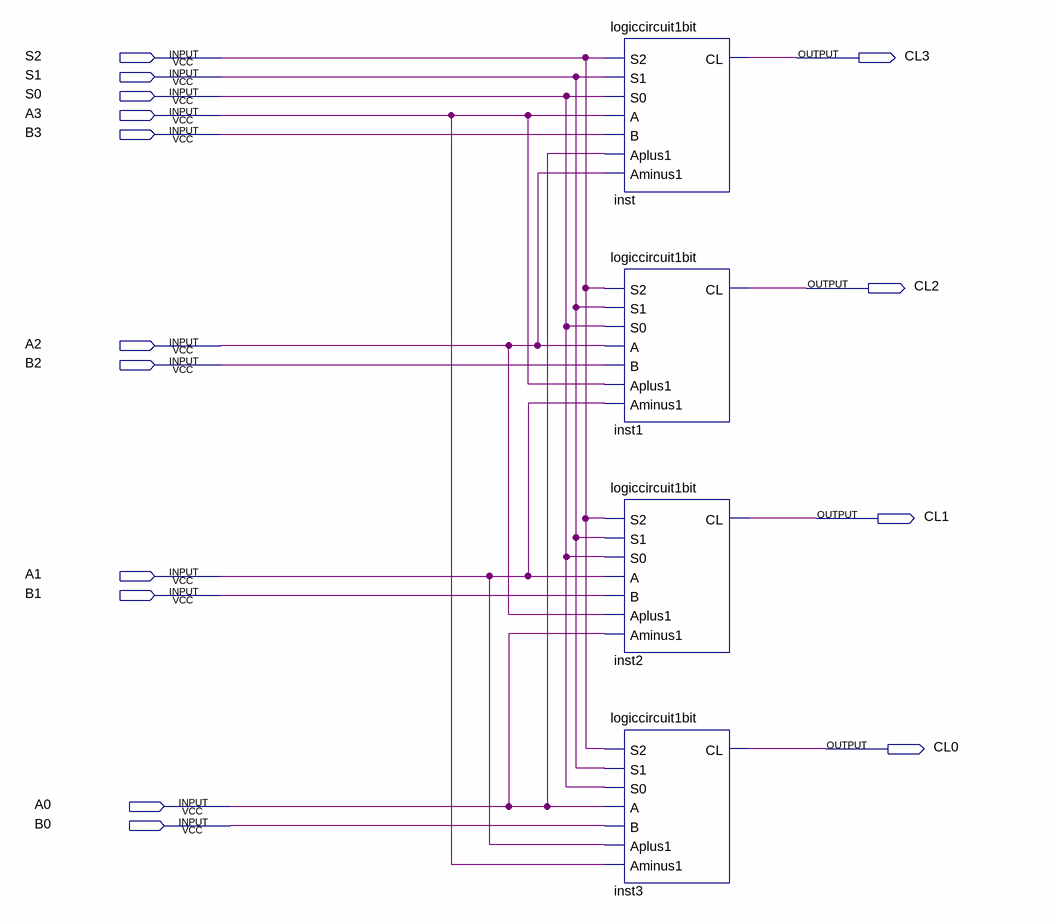
[diagram p0: schematic sheet]
// Quartus schematic logiccircuit4bit.bdf as structural Verilog: 4 symbols, 15 pins
module logiccircuit4bit (
  input  S2,
  input  S1,
  input  S0,
  input  A3,
  input  B3,
  input  A2,
  input  B2,
  input  A1,
  input  B1,
  input  A0,
  input  B0,
  output CL3,
  output CL2,
  output CL1,
  output CL0
);

  logiccircuit1bit inst (.S2(S2), .S1(S1), .S0(S0), .A(A3), .B(B3), .Aplus1(A0), .Aminus1(A2), .CL(CL3));
  logiccircuit1bit inst1 (.S2(S2), .S1(S1), .S0(S0), .A(A2), .B(B2), .Aplus1(A3), .Aminus1(A1), .CL(CL2));
  logiccircuit1bit inst2 (.S2(S2), .S1(S1), .S0(S0), .A(A1), .B(B1), .Aplus1(A2), .Aminus1(A0), .CL(CL1));
  logiccircuit1bit inst3 (.S2(S2), .S1(S1), .S0(S0), .A(A0), .B(B0), .Aplus1(A1), .Aminus1(A3), .CL(CL0));
endmodule
